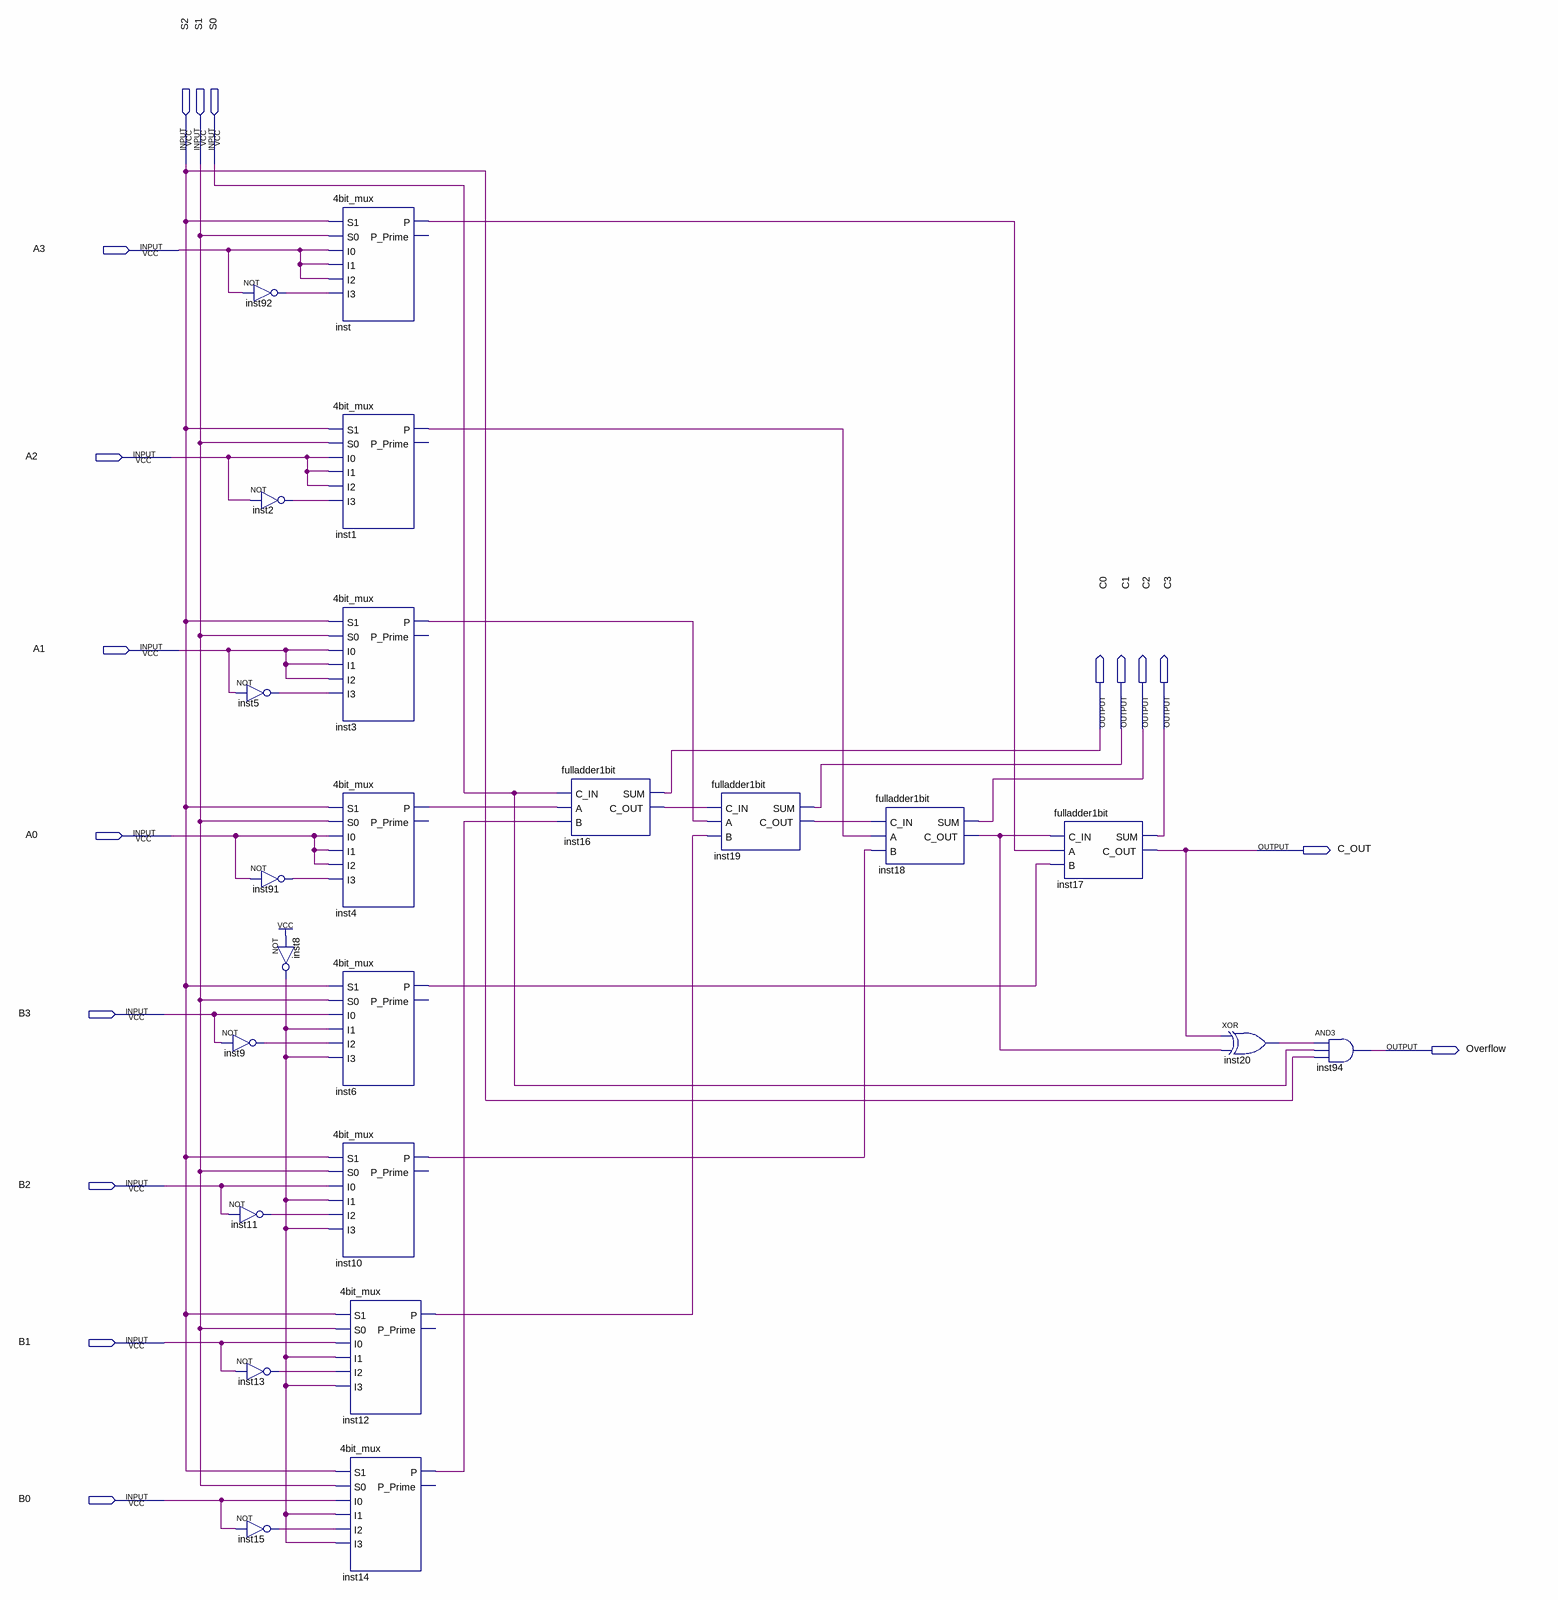
[diagram p0: schematic sheet]
// Quartus schematic arithcircuit4bits.bdf as structural Verilog: 23 symbols, 17 pins
module arithcircuit4bits (
  input  S2,
  input  S1,
  input  S0,
  input  A3,
  input  A2,
  input  A1,
  input  A0,
  input  B3,
  input  B2,
  input  B1,
  input  B0,
  output C0,
  output C1,
  output C2,
  output C3,
  output C_OUT,
  output Overflow
);

  wire inst1_p, inst2_out, inst3_p, inst4_p, inst5_out, inst6_p, inst8_out, inst9_out, inst10_p, inst11_out,
       inst12_p, inst13_out, inst14_p, inst15_out, inst16_c_out, inst18_c_out, inst19_c_out, inst20_out,
       inst91_out, inst92_out, inst_p;

  not inst9 (inst9_out, B3);
  not inst92 (inst92_out, A3);
  not inst2 (inst2_out, A2);
  not inst5 (inst5_out, A1);
  not inst91 (inst91_out, A0);
  not inst8 (inst8_out, 1'b1);
  not inst11 (inst11_out, B2);
  not inst13 (inst13_out, B1);
  not inst15 (inst15_out, B0);
  \4bit_mux  inst (.S1(S2), .S0(S1), .I0(A3), .I1(A3), .I2(A3), .I3(inst92_out), .P(inst_p));  // open: P_Prime
  \4bit_mux  inst1 (.S1(S2), .S0(S1), .I0(A2), .I1(A2), .I2(A2), .I3(inst2_out), .P(inst1_p));  // open: P_Prime
  \4bit_mux  inst3 (.S1(S2), .S0(S1), .I0(A1), .I1(A1), .I2(A1), .I3(inst5_out), .P(inst3_p));  // open: P_Prime
  \4bit_mux  inst4 (.S1(S2), .S0(S1), .I0(A0), .I1(A0), .I2(A0), .I3(inst91_out), .P(inst4_p));  // open: P_Prime
  \4bit_mux  inst6 (
    .S1(S2), .S0(S1), .I0(B3), .I1(inst8_out), .I2(inst9_out), .I3(inst8_out), .P(inst6_p));  // open: P_Prime
  \4bit_mux  inst10 (
    .S1(S2), .S0(S1), .I0(B2), .I1(inst8_out), .I2(inst11_out), .I3(inst8_out), .P(inst10_p));  // open: P_Prime
  \4bit_mux  inst12 (
    .S1(S2), .S0(S1), .I0(B1), .I1(inst8_out), .I2(inst13_out), .I3(inst8_out), .P(inst12_p));  // open: P_Prime
  \4bit_mux  inst14 (
    .S1(S2), .S0(S1), .I0(B0), .I1(inst8_out), .I2(inst15_out), .I3(inst8_out), .P(inst14_p));  // open: P_Prime
  fulladder1bit inst16 (.C_IN(S0), .A(inst4_p), .B(inst14_p), .SUM(C0), .C_OUT(inst16_c_out));
  fulladder1bit inst19 (.C_IN(inst16_c_out), .A(inst3_p), .B(inst12_p), .SUM(C1), .C_OUT(inst19_c_out));
  fulladder1bit inst18 (.C_IN(inst19_c_out), .A(inst1_p), .B(inst10_p), .SUM(C2), .C_OUT(inst18_c_out));
  fulladder1bit inst17 (.C_IN(inst18_c_out), .A(inst_p), .B(inst6_p), .SUM(C3), .C_OUT(C_OUT));
  xor inst20 (inst20_out, C_OUT, inst18_c_out);
  and inst94 (Overflow, inst20_out, S0, S2);
endmodule
